# Altium schematic sheet Main.SchDoc: Main
size A4; Author: Matheus Gois Vieira; Address1: UnB; Address2: Faculdade do Gama
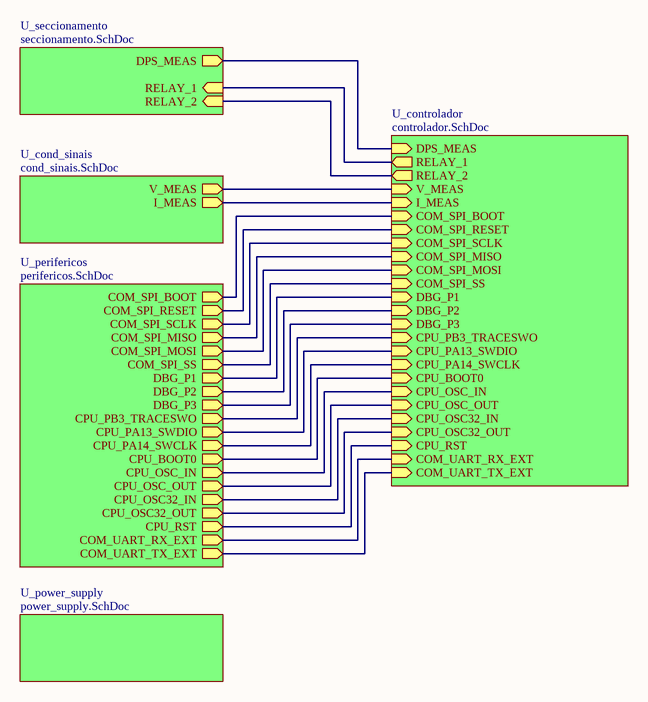
[diagram p0: Main.SchDoc]

## Sub-sheets
U_cond_sinais = cond_sinais.SchDoc: V_MEAS (out), I_MEAS (out)
U_controlador = controlador.SchDoc: DPS_MEAS (in), RELAY_2 (out), RELAY_1 (out), V_MEAS (in), I_MEAS (in), CPU_OSC_IN (in), CPU_OSC_OUT (in), CPU_OSC32_IN (in), CPU_OSC32_OUT (in), CPU_RST (in), COM_SPI_BOOT (in), COM_SPI_SS (in), COM_SPI_SCLK (in), COM_SPI_MISO (in), COM_SPI_MOSI (in), CPU_PA13_SWDIO (in), CPU_PA14_SWCLK (in), CPU_PB3_TRACESWO (in), DBG_P2 (in), DBG_P1 (in), CPU_BOOT0 (in), DBG_P3 (in), COM_SPI_RESET (in), COM_UART_RX_EXT (in), COM_UART_TX_EXT (in)
U_perifericos = perifericos.SchDoc: COM_SPI_BOOT (out), COM_SPI_RESET (out), COM_SPI_SCLK (out), COM_SPI_MISO (out), COM_SPI_MOSI (out), DBG_P1 (out), DBG_P2 (out), DBG_P3 (out), CPU_RST (out), CPU_PB3_TRACESWO (out), CPU_PA13_SWDIO (out), CPU_PA14_SWCLK (out), CPU_BOOT0 (out), CPU_OSC_IN (out), CPU_OSC_OUT (out), CPU_OSC32_IN (out), CPU_OSC32_OUT (out), COM_SPI_SS (out), COM_UART_RX_EXT (out), COM_UART_TX_EXT (out)
U_power_supply = power_supply.SchDoc: no entries
U_seccionamento = seccionamento.SchDoc: RELAY_1 (in), RELAY_2 (in), DPS_MEAS (out)

## Nets
(unnamed): sheet U_seccionamento/RELAY_1, sheet U_controlador/RELAY_1
(unnamed): sheet U_seccionamento/RELAY_2, sheet U_controlador/RELAY_2
(unnamed): sheet U_seccionamento/DPS_MEAS, sheet U_controlador/DPS_MEAS
(unnamed): sheet U_cond_sinais/V_MEAS, sheet U_controlador/V_MEAS
(unnamed): sheet U_cond_sinais/I_MEAS, sheet U_controlador/I_MEAS
(unnamed): sheet U_perifericos/COM_SPI_BOOT, sheet U_controlador/COM_SPI_BOOT
(unnamed): sheet U_perifericos/COM_SPI_RESET, sheet U_controlador/COM_SPI_RESET
(unnamed): sheet U_perifericos/COM_SPI_SCLK, sheet U_controlador/COM_SPI_SCLK
(unnamed): sheet U_perifericos/COM_SPI_MISO, sheet U_controlador/COM_SPI_MISO
(unnamed): sheet U_perifericos/COM_SPI_MOSI, sheet U_controlador/COM_SPI_MOSI
(unnamed): sheet U_perifericos/DBG_P1, sheet U_controlador/DBG_P1
(unnamed): sheet U_perifericos/DBG_P2, sheet U_controlador/DBG_P2
(unnamed): sheet U_perifericos/DBG_P3, sheet U_controlador/DBG_P3
(unnamed): sheet U_perifericos/CPU_RST, sheet U_controlador/CPU_RST
(unnamed): sheet U_perifericos/CPU_PB3_TRACESWO, sheet U_controlador/CPU_PB3_TRACESWO
(unnamed): sheet U_perifericos/CPU_PA13_SWDIO, sheet U_controlador/CPU_PA13_SWDIO
(unnamed): sheet U_perifericos/CPU_PA14_SWCLK, sheet U_controlador/CPU_PA14_SWCLK
(unnamed): sheet U_perifericos/CPU_BOOT0, sheet U_controlador/CPU_BOOT0
(unnamed): sheet U_perifericos/CPU_OSC_IN, sheet U_controlador/CPU_OSC_IN
(unnamed): sheet U_perifericos/CPU_OSC_OUT, sheet U_controlador/CPU_OSC_OUT
(unnamed): sheet U_perifericos/CPU_OSC32_IN, sheet U_controlador/CPU_OSC32_IN
(unnamed): sheet U_perifericos/CPU_OSC32_OUT, sheet U_controlador/CPU_OSC32_OUT
(unnamed): sheet U_perifericos/COM_SPI_SS, sheet U_controlador/COM_SPI_SS
(unnamed): sheet U_perifericos/COM_UART_RX_EXT, sheet U_controlador/COM_UART_RX_EXT
(unnamed): sheet U_perifericos/COM_UART_TX_EXT, sheet U_controlador/COM_UART_TX_EXT

## Notes on the sheet
- Title
- Size:
- Date:
- A4
- Author:
- Time:
- Sheet
- of
- File: